# Altium schematic sheet POWER.SchDoc
size A4; SheetNumber: 5; SheetTotal: 6
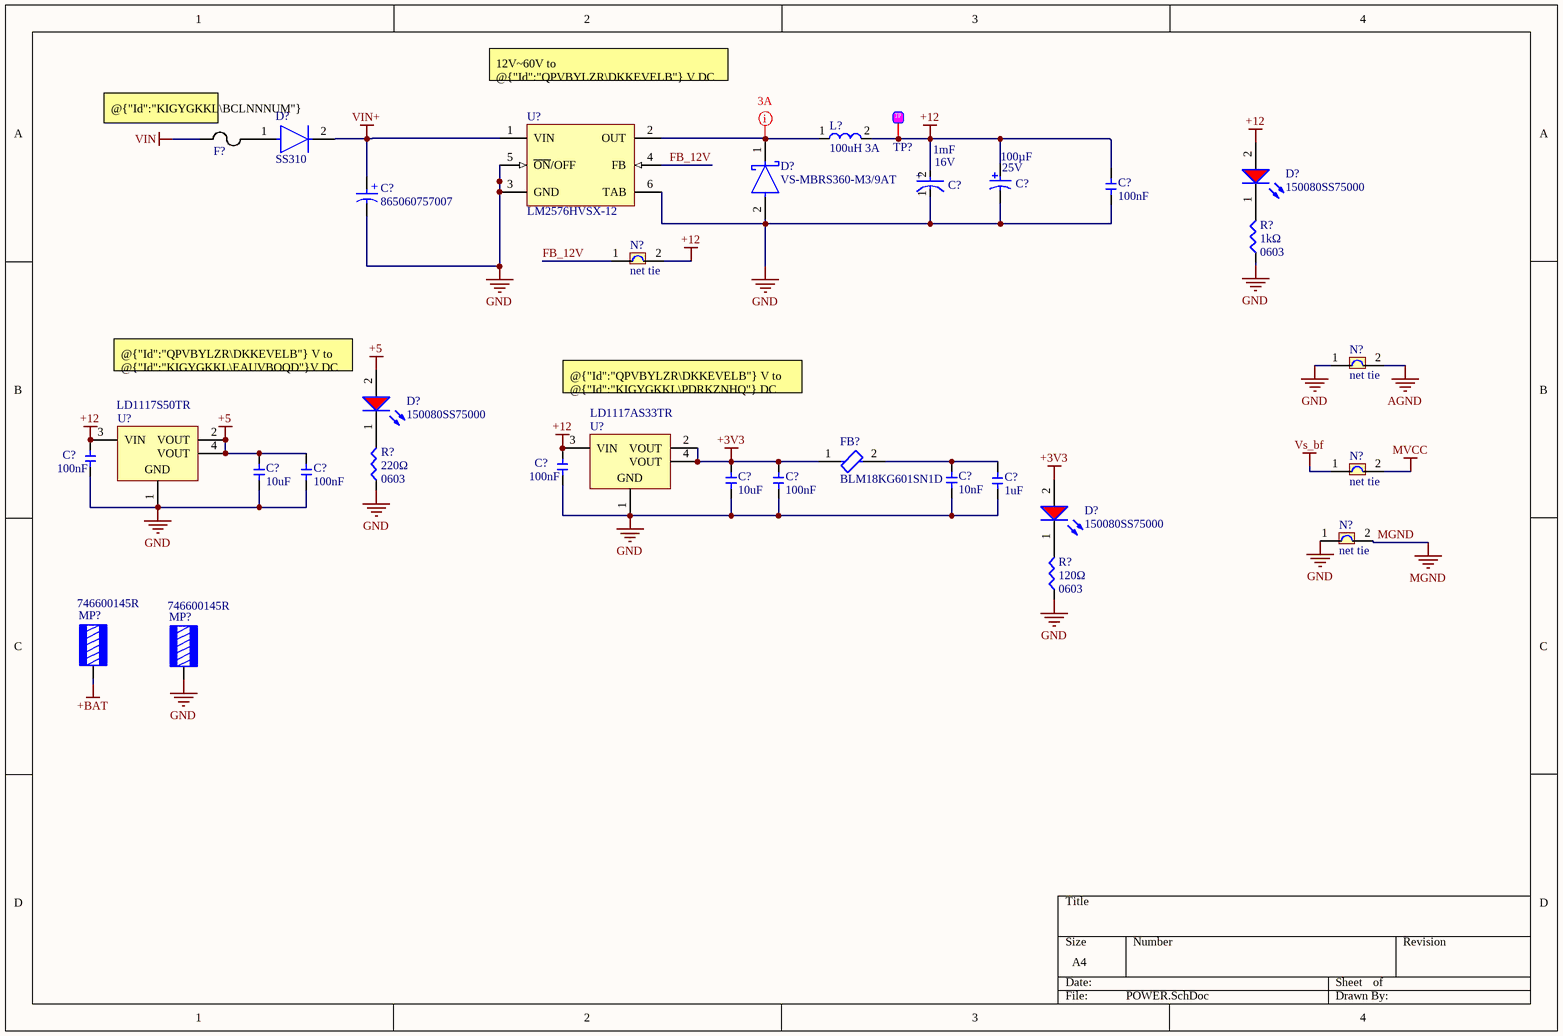
[diagram p0: POWER.SchDoc]

## Parts
(Parts that share a designator on the sheet are numbered #1, #2 ... from top to bottom, then left to right.)
C?#1  Capacitance: 100µF  Rated Voltage: 25V  [PNSC-FK-V-D8_V]  (hidden comment: EEEFK1E101XP)
C?#2  Voltage Rating (DC): 16V  Capacitance: 1mF  [FP-FTG-MFG]  (hidden comment: EEEFT1C102AP)
C?#3  865060757007  [WCAP-ASLL_D10H10.5]
C?#4  value 100nF  [0603_cap]  (hidden comment: 0603_100nF)
C?#5  value 100nF  [0603_cap]  (hidden comment: 0603_100nF)
C?#6  value 100nF  [0603_cap]  (hidden comment: 0603_100nF)
C?#7  value 10uF  [0603_cap]  (hidden comment: 0603_10uF)
C?#8  value 100nF  [0603_cap]  (hidden comment: 0603_100nF)
C?#9  value 10uF  [0603_cap]  (hidden comment: 0603_10uF)
C?#10  value 100nF  [0603_cap]  (hidden comment: 0603_100nF)
C?#11  value 10nF  [0603_cap]  (hidden comment: 0603_10nF)
C?#12  value 1uF  [0603_cap]  (hidden comment: 0603_1uF)
D?#1  SS310  [DO-214AC]
D?#2  150080SS75000  [WL-SMCW_0805_150080xx75000]
D?#3  VS-MBRS360-M3/9AT  [FP-95402-MFG]
D?#4  150080SS75000  [WL-SMCW_0805_150080xx75000]
D?#5  150080SS75000  [WL-SMCW_0805_150080xx75000]
F?  SBF32152ASTP  [1206_res]  (value not drawn)
FB?  BLM18KG601SN1D  [FP-BLM18-0_15-t0_8-IPC_A]
L?  100uH 3A  [MWSA1206S]
MP?#1  746600145R  [746600145]
MP?#2  746600145R  [746600145]
N?#1  net tie  [net tie]  (net tie, no BOM)
N?#2  net tie  [net tie]  (net tie, no BOM)
N?#3  net tie  [net tie]  (net tie, no BOM)
N?#4  net tie  [net tie]  (net tie, no BOM)
R?#1  value 1kΩ  Package: 0603  [0603-smd]  (hidden comment: 0603_1K)
R?#2  value 220Ω  Package: 0603  [0603-smd]  (hidden comment: 0603_220R)
R?#3  value 120Ω  Package: 0603  [0603-smd]  (hidden comment: 0603_120R)
TP?  Test Point  [test_point]  (value not drawn)
U?#1  LM2576HVSX-12  [KTT0005B_L]
U?#2  LD1117S50TR  [SOT-223_L]
U?#3  LD1117AS33TR  [SOT-223_L]

## Nets
+3V3: C?#9.2 C?#10.2 D?#5.2(A) FB?.1 U?#3.2(VOUT) U?#3.4(VOUT)
+5: C?#7.2 C?#8.2 D?#4.2(A) U?#2.2(VOUT) U?#2.4(VOUT)
+12: C?#1.1 C?#2.2(A) C?#4.2 C?#5.2 C?#6.2 D?#2.2(A) L?.2 N?#1.2 TP?.1 U?#2.3(VIN) U?#3.3(VIN)
+BAT: MP?#1.1
AGND: N?#2.2
GND: C?#1.2 C?#2.1(C) C?#3.2(N) C?#4.1 C?#5.1 C?#6.1 C?#7.1 C?#8.1 C?#9.1 C?#10.1 C?#11.1 C?#12.1 D?#3.2(A) MP?#2.1 N?#2.1 N?#4.1 R?#1.1 R?#2.1 R?#3.1 U?#1.3(GND) U?#1.5(~{ON}/OFF) U?#1.6(TAB) U?#2.1(GND) U?#3.1(GND)
MGND: N?#4.2
MVCC: N?#3.2
VIN: F?.1
VIN+: C?#3.1(P) D?#1.2 U?#1.1(VIN)
Vs_bf: N?#3.1
FB_12V: N?#1.1 U?#1.4(FB)
NetC?#11_2: C?#11.2 C?#12.2 FB?.2
NetD?#1_1: D?#1.1 F?.2
NetD?#2_1: D?#2.1(K) R?#1.2
NetD?#3_1: D?#3.1(C) L?.1 U?#1.2(OUT)
NetD?#4_1: D?#4.1(K) R?#2.2
NetD?#5_1: D?#5.1(K) R?#3.2

## Layout directives
mark named 3A: NetD?#3_1

## Notes on the sheet
- 12V~60V to @{"Id":"QPVBYLZR\DKKEVELB"} V DC CONVERTER
- (near F?) @{"Id":"KIGYGKKL\BCLNNNUM"} is till 60V
- (near D?#4) @{"Id":"QPVBYLZR\DKKEVELB"} V to @{"Id":"KIGYGKKL\EAUVBOQD"}V DC CONVERTER
- @{"Id":"QPVBYLZR\DKKEVELB"} V to @{"Id":"KIGYGKKL\PDRKZNHQ"} DC CONVERTER
- (in symbol CMP-03913-89507486-1) +
- (in symbol CMP-05427-000086-1) +

## Library data of the parts
C?#1 = CMP-2000-06206-1: Aluminum Electrolytic Capacitor, 100 uF, +/- 20%, 25 V, 2-Pin SMD (Size Code D8), -55 to 105 degC, RoHS, Tape and Reel; Manufacturer: Panasonic; Type: Can; Lifetime@Temperature: 2000Hrs@105°C; Ripple Current: 280mA; Impedance: 0.34O; Case Size/Dimension: Ø6.3x7.7mm; Operating Temp-Max: 105°C; Series: FK; Package URL: http://industrial.panasonic.com/cdbs/www-data/pdf/RDE0000/DME0000COL48.pdf; Mounting Technology: SurfaceMount; Package Description: 2-Pin Electrolytic Aluminum Capacitor, Body 6.6 x 6.6 mm; Datasheet Version: 03/2016; Datasheet URL: http://industrial.panasonic.com/cdbs/www-data/pdf/RDE0000/ABA0000C1181.pdf; Manufacturer URL: http://www.panasonic.com/; Package Reference: FK-V-D8; Operating Temp Range: -55to+105°C
C?#2 = CMP-05427-000086-1: CAP ALUM 1000UF 20% 16V SMD; Life (Hours): 2000Hour; Ripple Current: 1.19A; ESR (Equivalent Series Resistance): 60mR; Leakage Current: 160uA; Lead Diameter: 0.9mm; Height: 10.2mm; Radiation Hardening: No; Tolerance: 20%; Lead Free: Lead Free; Construction: Cylindrical; Package Quantity: 1; REACH SVHC: No SVHC; Series: FT; Packaging: Tape and Reel; RoHS Compliant: Yes; Lead Pitch: 4.6mm; Diameter: 10mm; Voltage Rating: 16V; Height - Seated (Max): 0.413inch; Length: 10.2mm; Voltage: 16V; Max Operating Temperature: 105°C; Ripple Current (AC): 1.19A; Min Operating Temperature: -55°C; Termination: SMD/SMT; Mount: Surface Mount; Case/Package: Radial
C?#3 = CMP-03913-89507486-1: 865060757007 WCAP-ASLL Aluminum Electrolytic Capacitors; Leakage Current: 63µA; Voltage Rating: 63V; Ripple Current: 420mA; Insulation Resistance: 1MΩ; Impedance: 240mΩ; Capacitance: 100µF; NexarPartId: 89507486; Diameter: 10mm; RoHS: Non-Compliant; Width: 10.3mm; Height: 10.5mm; Voltage Rating (DC): 63V; Length: 10.5mm; Packaging: Cut Tape
C?#4-C?#6 C?#8 C?#10 = 0603_100nF: Volt: V; Package: 0603
C?#7 C?#9 = 0603_10uF: Volt: V; Package: 0603
C?#11 = 0603_10nF: Volt: V; Package: 0603
C?#12 = 0603_1uF: Volt: V; Package: 0603
D?#2 D?#4 D?#5 = CMP-1426-00010-3: NexarPartId: 29717782; Peak Wavelength: 645nm; Luminous Intensity: 60mcd; Max Junction Temperature (Tj): 95°C; Wavelength: 630nm; Forward Current: 100mA; Max Reverse Voltage (DC): 5V; Color: Red; Lens Style: Clear, Rectangular; Test Current: 20mA; Power Dissipation: 72mW; Viewing Angle: 140°; Forward Voltage: 1.9V; Case Code (Metric): 2012; Max Operating Temperature: 85°C; Mount: Surface Mount; Height: 700µm; Case/Package: 0805; Min Operating Temperature: -40°C; Reverse Voltage: 5V; RoHS: Compliant; Packaging: Tape and Reel; REACH SVHC: Unknown; Case Code (Imperial): 0805; Length: 2mm; Width: 1.25mm; Dominant Wavelength: 630nm
D?#3 = CMP-02539-000065-1: DIODE SCHOTTKY 60V 3A DO214AB; Peak Non-Repetitive Surge Current: 790A; Forward Voltage: 740mV; Max Reverse Current: 500uA; Element Configuration: Single; Min Operating Temperature: -55°C; Packaging: Tape and Reel; Average Rectified Current: 3A; Max Operating Temperature: 150°C; Number of Pins: 2; Mount: Surface Mount; Contact Plating: Tin; Case/Package: DO-214AB; Max Forward Surge Current (Ifsm): 790A; Max Reverse Voltage (DC): 60V; Reach SVHC Compliant: Yes; RoHS Compliant: Yes; Forward Current: 3A; Max Repetitive Reverse Voltage (Vrrm): 60V; Series: -; Lead Free: Lead Free
F? = SBF32152ASTP: Fuse Chip 1.5A 63VDC 1206; Manufacturer: Kamaya; Supplier 1: Mouser; Manufacturer Part Number: SBF32152ASTP; Supplier Part Number 1: 791-SBF32152ASTP
FB? = CMP-0686-00581-3: Chip Ferrite Bead, 0603, 600Ω @ 100MHz, 0.15Ω, 25%, 1.3A; Material: Steel; Number of Lines: 1; Impedance: 600R; DC Resistance (DCR): 150mR; Tolerance: 25%; Case Code (Metric): 1608; Width: 0.8mm; DC Current: 1.3A; Max DC Current: 1.3A; Package Quantity: 1; Number of Pins: 2; Military Standard: Not; RoHS Compliant: Yes; Termination: SMD/SMT; Max Operating Temperature: 125°C; Length: 1.6mm; Depth: 0.8mm; Case Code (Imperial): 0603; Series: BLM18K; Inductor Type: FERRITE BEAD; Core Material: Ferrite; Number of Circuits: 1; Height: 0.8mm; Case/Package: 0603; REACH SVHC: No SVHC; Packaging: Tape and Reel; Min Operating Temperature: -55°C; Max Current Rating: 1.3A; Radiation Hardening: No; Current Rating: 1.3A; Lead Free: Lead Free; Test Frequency: 100MHz; Weight: 7.1E-05oz
L? = MWSA1206S: Supplier 1: Digi-Key; ComponentLink1Description: datasheet; ComponentLink1URL: https://mm.digikey.com/Volume0/opasdata/d220001/medias/docus/2905/MWSA-S_Series_DS.pdf; Supplier Part Number 1: 3442-MWSA1206S-101MTCT-ND
MP?#1 MP?#2 = CMP-03913-99674487-1: 746600145R SMT REDCUBE Bush Reverse with Through Hole, 4.5 mm Ø Internal Hole, 86A, Vertical, WP-SMRT; Current Rating: 85A; RoHS: Compliant; Min Operating Temperature: -55°C; Max Operating Temperature: 150°C; Height: 3mm; Packaging: Tape and Reel; NexarPartId: 99674487; Material: Brass
R?#1 = 0603_1K: Power: W
R?#2 = 0603_220R: Power: W
R?#3 = 0603_120R: Power: W
TP? = TP
U?#1 = CMP-0069-00140-3: SIMPLE SWITCHER® 3A Step-Down Voltage Regulator, 5-pin TO-263; Manufacturer: Texas Instruments; PowerWise: N; PackageTopMarking: NSUZXYTTE#*LM2576*HVS-12 P+; PackageReference: KTT0005B; CompType: Switcher; RoHS: N; ComponentLink1URL: http://www.ti.com/general/docs/lit/getliterature.tsp?genericPartNumber=LM2576HV&fileType=pdf; Code_JEDEC: MO-169-AB; ComponentLink1Description: Datasheet URL; PackageDescription: TO-263, Molded, .400 x .390 x .180in, 5 Lead, .067in Pitch, Surface Mount; PinCount: 5
U?#2 = CMP-0244-00312-1: Fixed Low Drop Positive Voltage Regulator, 5V, 4-Pin SOT-223, Tape and Reel; ComponentLink1URL: http://www.st.com; DatasheetVersion: 1/11/2011; PackageDescription: 4-Pin SOT-223 Package, 6.5 x 3.5 mm Body, 2.3 mm Pitch, 7 mm Lead Span; ComponentLink2URL: http://www.st.com/internet/com/TECHNICAL_RESOURCES/TECHNICAL_LITERATURE/DATASHEET/CD00000544.pdf; ComponentLink1Description: Manufacturer URL; PackageReference: SOT-223; PackageVersion: 2010; ComponentLink2Description: Datasheet
U?#3 = CMP-0244-00316-1: 1A, Low Drop Positive Voltage Regulator, 3.3V, 4-Pin SOT-223, Tape and Reel; ComponentLink1Description: Manufacturer URL; DatasheetVersion: 2/12/2011; PackageVersion: 2010; ComponentLink1URL: http://www.st.com; ComponentLink2Description: Datasheet; ComponentLink2URL: http://www.st.com/internet/com/TECHNICAL_RESOURCES/TECHNICAL_LITERATURE/DATASHEET/CD00002116.pdf; PackageDescription: 4-Pin SOT-223 Package, 6.5 x 3.5 mm Body, 2.3 mm Pitch, 7 mm Lead Span; PackageReference: SOT-223
D?#1 = SS310: Supplier 1: Digi-Key; Supplier Part Number 1: 1801-SS310CT-ND